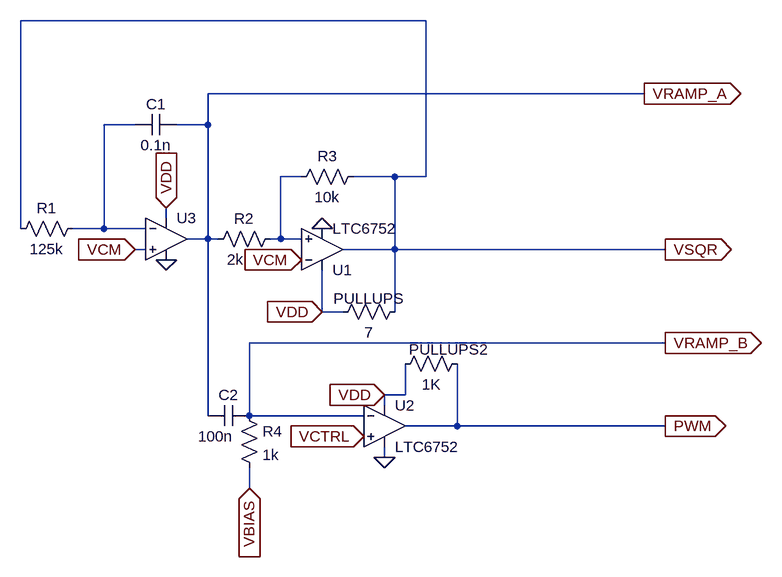
[diagram p0: schematic analoglab_1.asc]
analoglab_1.asc, the LTspice schematic file:
Version 4.1
SHEET 1 1268 728
WIRE 576 -176 -48 -176
WIRE 912 -64 240 -64
WIRE 128 -16 80 -16
WIRE 240 -16 240 -64
WIRE 240 -16 192 -16
WIRE 384 64 352 64
WIRE 528 64 464 64
WIRE 576 64 576 -176
WIRE 576 64 528 64
WIRE 176 128 176 112
WIRE -48 144 -48 -176
WIRE 80 144 80 -16
WIRE 80 144 32 144
WIRE 144 144 80 144
WIRE 240 160 240 -16
WIRE 240 160 208 160
WIRE 256 160 240 160
WIRE 352 160 352 64
WIRE 352 160 336 160
WIRE 384 160 352 160
WIRE 144 176 128 176
WIRE 528 176 528 64
WIRE 528 176 448 176
WIRE 944 176 528 176
WIRE 416 272 416 208
WIRE 448 272 416 272
WIRE 528 272 528 176
WIRE 944 320 304 320
WIRE 544 400 544 352
WIRE 544 400 512 400
WIRE 512 416 512 400
WIRE 240 432 240 160
WIRE 304 432 304 320
WIRE 480 432 304 432
WIRE 624 448 624 352
WIRE 624 448 544 448
WIRE 944 448 624 448
WIRE 512 496 512 480
WIRE 304 544 304 512
FLAG 512 496 0
FLAG 176 192 0
FLAG 128 176 VCM
IOPIN 128 176 In
FLAG 176 112 VDD
IOPIN 176 112 In
FLAG 416 272 VDD
IOPIN 416 272 In
FLAG 512 400 VDD
IOPIN 512 400 In
FLAG 480 464 VCTRL
IOPIN 480 464 In
FLAG 384 192 VCM
IOPIN 384 192 In
FLAG 912 -64 VRAMP_A
IOPIN 912 -64 Out
FLAG 944 320 VRAMP_B
IOPIN 944 320 Out
FLAG 944 176 VSQR
IOPIN 944 176 Out
FLAG 944 448 PWM
IOPIN 944 448 Out
FLAG 416 144 0
FLAG 304 544 VBIAS
IOPIN 304 544 In
SYMBOL res 48 128 R90
WINDOW 0 0 56 VBottom 2
WINDOW 3 32 56 VTop 2
SYMATTR InstName R1
SYMATTR Value 125k
SYMBOL res 352 144 R90
WINDOW 0 0 56 VBottom 2
WINDOW 3 32 70 VTop 2
SYMATTR InstName R2
SYMATTR Value 2k
SYMBOL res 480 48 R90
WINDOW 0 0 56 VBottom 2
WINDOW 3 32 56 VTop 2
SYMATTR InstName R3
SYMATTR Value 10k
SYMBOL cap 304 416 R90
WINDOW 0 0 32 VBottom 2
WINDOW 3 32 52 VTop 2
SYMATTR InstName C2
SYMATTR Value 100n
SYMBOL res 288 416 R0
SYMATTR InstName R4
SYMATTR Value 1k
SYMBOL res 544 256 R90
WINDOW 0 11 56 VBottom 2
WINDOW 3 32 56 VTop 2
SYMATTR InstName PULLUPS
SYMATTR Value 7
SYMBOL res 640 336 R90
WINDOW 0 10 29 VBottom 2
WINDOW 3 32 56 VTop 2
SYMATTR InstName PULLUPS2
SYMATTR Value 1K
SYMBOL cap 192 -32 R90
WINDOW 0 0 32 VBottom 2
WINDOW 3 32 32 VTop 2
SYMATTR InstName C1
SYMATTR Value 0.1n
SYMBOL Comparators\\LTC6752 512 384 R0
SYMATTR InstName U2
SYMBOL Comparators\\LTC6752 416 240 M180
SYMATTR InstName U1
SYMBOL Opamps\\UniversalOpamp2 176 160 R0
SYMATTR InstName U3

The netlist it stands for:
* analoglab_1.asc
R1 N001 VSQR 125k
R2 N002 VRAMP_A 2k
R3 VSQR N002 10k
C2 VRAMP_B VRAMP_A 100n
R4 VRAMP_B VBIAS 1k
R§PULLUPS VSQR VDD 7
R§PULLUPS2 PWM VDD 1K
C1 VRAMP_A N001 0.1n
X§U2 VCTRL VRAMP_B VDD 0 PWM LTC6752  ; pins In+ In- V+ V- OUT
X§U1 N002 VCM VDD 0 VSQR LTC6752  ; pins In+ In- V+ V- OUT
X§U3 VCM N001 VDD 0 VRAMP_A level.2 Avol=1Meg GBW=10Meg Slew=10Meg ilimit=25m rail=0 Vos=0 phimargin=45 en=0 enk=0 in=0 ink=0 Rin=500Meg  ; pins IN+ IN- V+ V- OUT
.lib LTC7.lib
.lib UniversalOpamps2.sub
.backanno
.end